# EAGLE schematic Communication (EAGLE 9.5.2)
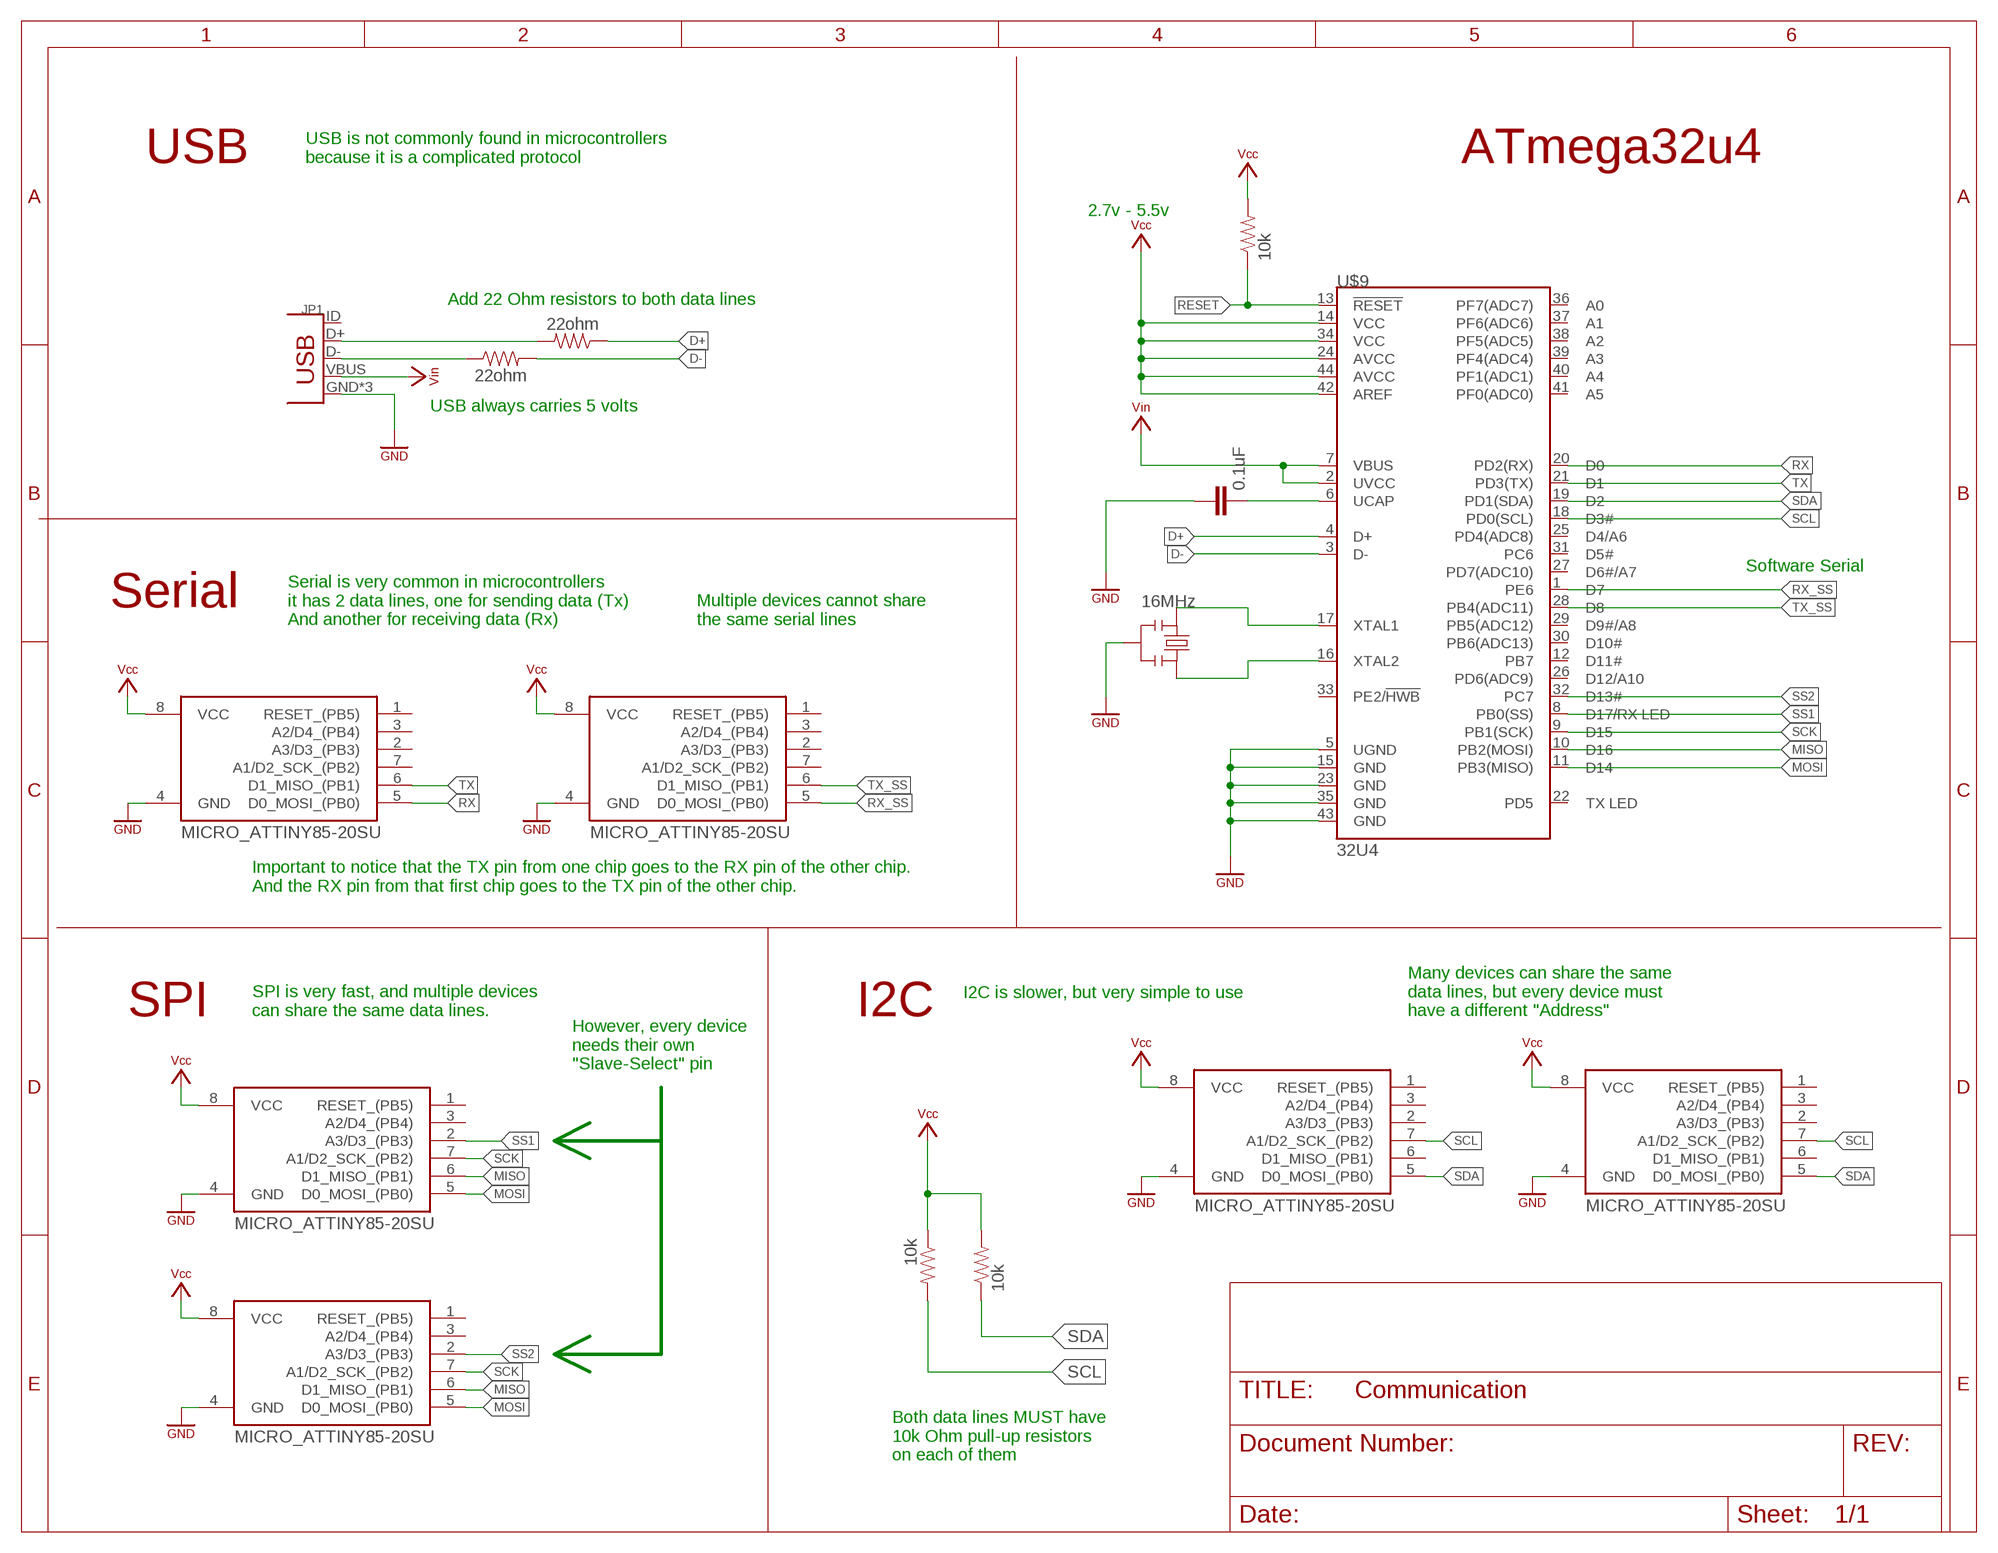
[diagram p0: schematic, sheet 1]

## Parts
C1  0.1uF  COMPONENT_CAP-0805  [0805]
JP1  CONN_USB-10118192-0001LF  [USB-MICRO-FEMALE]
R6  22ohm  COMPONENT_RESISTOR-0805  [0805]
R7  22ohm  COMPONENT_RESISTOR-0805  [0805]
R8  10k  COMPONENT_RESISTOR-0805  [0805]
R9  10k  COMPONENT_RESISTOR-0805  [0805]
R10  10k  COMPONENT_RESISTOR-0805  [0805]
U$3  MICRO_ATTINY85-20SU  [SOIC8]
U$4  MICRO_ATTINY85-20SU  [SOIC8]
U$5  MICRO_ATTINY85-20SU  [SOIC8]
U$6  MICRO_ATTINY85-20SU  [SOIC8]
U$7  MICRO_ATTINY85-20SU  [SOIC8]
U$8  MICRO_ATTINY85-20SU  [SOIC8]
U$9  32U4  MICRO_ATMEGA32U4TQFP-44  [TQFP44]
Y2  16MHz  COMPONENT_RESONATOR-1.2MM-PITCH  [RESONATOR-SMD]

## Nets
D+: R7.1 U$9.4(D+)
D-: R6.2 U$9.3(D-)
GND: C1.1 JP1.GND JP1.MT1(GND) JP1.MT2(GND) U$3.4(GND) U$4.4(GND) U$5.4(GND) U$6.4(GND) U$7.4(GND) U$8.4(GND) U$9.5(UGND) U$9.15(GND) U$9.23(GND) U$9.35(GND) U$9.43(GND) Y2.2 ; supply symbol labelled SYMBOL_GND
MISO: U$3.6(D1_MISO_(PB1)) U$4.6(D1_MISO_(PB1)) U$9.10(PB2(MOSI))
MOSI: U$3.5(D0_MOSI_(PB0)) U$4.5(D0_MOSI_(PB0)) U$9.11(PB3(MISO))
N$1: C1.2 U$9.6(UCAP)
N$2: U$9.17(XTAL1) Y2.1
N$3: U$9.16(XTAL2) Y2.3
N$5: JP1.D+ R7.2
N$6: JP1.D- R6.1
RESET: R10.1 U$9.13(!RESET)
RX: U$7.5(D0_MOSI_(PB0)) U$9.20(PD2(RX))
RX_SS: U$8.5(D0_MOSI_(PB0)) U$9.1(PE6)
SCK: U$3.7(A1/D2_SCK_(PB2)) U$4.7(A1/D2_SCK_(PB2)) U$9.9(PB1(SCK))
SCL: R8.2 U$5.7(A1/D2_SCK_(PB2)) U$6.7(A1/D2_SCK_(PB2)) U$9.18(PD0(SCL))
SDA: R9.1 U$5.5(D0_MOSI_(PB0)) U$6.5(D0_MOSI_(PB0)) U$9.19(PD1(SDA))
SS1: U$3.2(A3/D3_(PB3)) U$9.8(PB0(SS))
SS2: U$4.2(A3/D3_(PB3)) U$9.32(PC7)
TX: U$7.6(D1_MISO_(PB1)) U$9.21(PD3(TX))
TX_SS: U$8.6(D1_MISO_(PB1)) U$9.28(PB4(ADC11))
VCC: R8.1 R9.2 R10.2 U$3.8(VCC) U$4.8(VCC) U$5.8(VCC) U$6.8(VCC) U$7.8(VCC) U$8.8(VCC) U$9.14(VCC) U$9.24(AVCC) U$9.34(VCC) U$9.42(AREF) U$9.44(AVCC) ; supply symbol labelled SYMBOL_VCC
VIN: JP1.VBUS U$9.2(UVCC) U$9.7(VBUS) ; supply symbol labelled SYMBOL_VIN
Unconnected: JP1.ID(SHIELD) U$3.1(RESET_(PB5)) U$3.3(A2/D4_(PB4)) U$4.1(RESET_(PB5)) U$4.3(A2/D4_(PB4)) U$5.1(RESET_(PB5)) U$5.2(A3/D3_(PB3)) U$5.3(A2/D4_(PB4)) U$5.6(D1_MISO_(PB1)) U$6.1(RESET_(PB5)) U$6.2(A3/D3_(PB3)) U$6.3(A2/D4_(PB4)) U$6.6(D1_MISO_(PB1)) U$7.1(RESET_(PB5)) U$7.2(A3/D3_(PB3)) U$7.3(A2/D4_(PB4)) U$7.7(A1/D2_SCK_(PB2)) U$8.1(RESET_(PB5)) U$8.2(A3/D3_(PB3)) U$8.3(A2/D4_(PB4)) U$8.7(A1/D2_SCK_(PB2)) U$9.12(PB7) U$9.22(PD5) U$9.25(PD4(ADC8)) U$9.26(PD6(ADC9)) U$9.27(PD7(ADC10)) U$9.29(PB5(ADC12)) U$9.30(PB6(ADC13)) U$9.31(PC6) U$9.33(PE2/!HWB) U$9.36(PF7(ADC7)) U$9.37(PF6(ADC6)) U$9.38(PF5(ADC5)) U$9.39(PF4(ADC4)) U$9.40(PF1(ADC1)) U$9.41(PF0(ADC0))

## Notes on the sheet
- USB
- USB is not commonly found in microcontrollers
  because it is a complicated protocol
- ATmega32u4
- 2.7v - 5.5v
- Add 22 Ohm resistors to both data lines
- USB always carries 5 volts
- Software Serial
- Serial
- Serial is very common in microcontrollers
  it has 2 data lines, one for sending data (Tx)
  And another for receiving data (Rx)
- Multiple devices cannot share
  the same serial lines
- Important to notice that the TX pin from one chip goes to the RX pin of the other chip.
  And the RX pin from that first chip goes to the TX pin of the other chip.
- I2C is slower, but very simple to use
- SPI
- SPI is very fast, and multiple devices
  can share the same data lines.
- I2C
- Many devices can share the same
  data lines, but every device must
  have a different "Address"
- However, every device
  needs their own
  "Slave-Select" pin
- Both data lines MUST have
  10k Ohm pull-up resistors
  on each of them

## Library data of the parts
C1 = homemade-hardware:COMPONENT_CAP: Capacitor Standard 0603 ceramic capacitor, and 0.1" leaded capacitor.
JP1 = homemade-hardware:CONN_USB: 1-1734346-1 <https://www.digikey.com/product-detail/en/te-connectivity-amp-connectors/1-1734346-1/A110862CT-ND/4142246>: USB-B Female Receptacle 10118192-0001LF <https://www.digikey.com/products/en/connectors-interconnects/usb-dvi-hdmi-connectors/312?k=10118192-0001lf&k=&pkeyword=10118192-0001lf&sv=0&pv7=2&sf=0&quantity=&ColumnSort=0&page=1&pageSize=25>: USB-Micro Receptacle 87583-3010RPALF <https://www.digikey.com/product-detail/en/amphenol-icc-fci/87583-3010RPALF/609-4946-6-ND/5355479>: USB-A Female Receptacle 0480372100 <https://www.digikey.com/product-detail/en/molex/0480372100/WM13995DKR-ND/6204368>: USB-A Male Connector; PROD_ID: CONN-09505
R6-R10 = homemade-hardware:COMPONENT_RESISTOR
U$3-U$8 = homemade-hardware:MICRO_ATTINY85
U$9 = homemade-hardware:MICRO_ATMEGA32U4: ATMEGA32U4-AUR: Native USB Microcontroller (used in Arduino Leonardo); PROD_ID: IC-11161
Y2 = homemade-hardware:COMPONENT_RESONATOR: CSTNE8M00GH5C000R0 <https://www.digikey.com/product-detail/en/murata-electronics-north-america/CSTNE8M00GH5C000R0/490-17961-1-ND/8747769>: 8MHz resonator CSTNE12M0G55Z000R0 <https://www.digikey.com/product-detail/en/murata-electronics-north-america/CSTNE12M0G55Z000R0/490-17945-6-ND/8747780>: 12MHz resonator CSTNE16M0VH3C000R0 <https://www.digikey.com/product-detail/en/murata-electronics-north-america/CSTNE16M0VH3C000R0/490-17951-1-ND/8747759>: 16MHz resonator